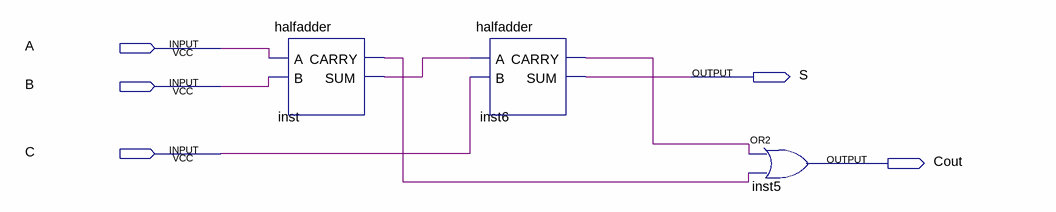
[diagram p0: schematic sheet]
// Quartus schematic fulladder.bdf as structural Verilog: 3 symbols, 5 pins
module fulladder (
  input  A,
  input  B,
  input  C,
  output S,
  output Cout
);

  wire inst6_carry, inst_carry, inst_sum;

  halfadder inst (.A(A), .B(B), .CARRY(inst_carry), .SUM(inst_sum));
  halfadder inst6 (.A(inst_sum), .B(C), .CARRY(inst6_carry), .SUM(S));
  or inst5 (Cout, inst6_carry, inst_carry);
endmodule
